# Altium schematic sheet MOSFET_bank.SchDoc
size B; SheetNumber: 2; SheetTotal: 4
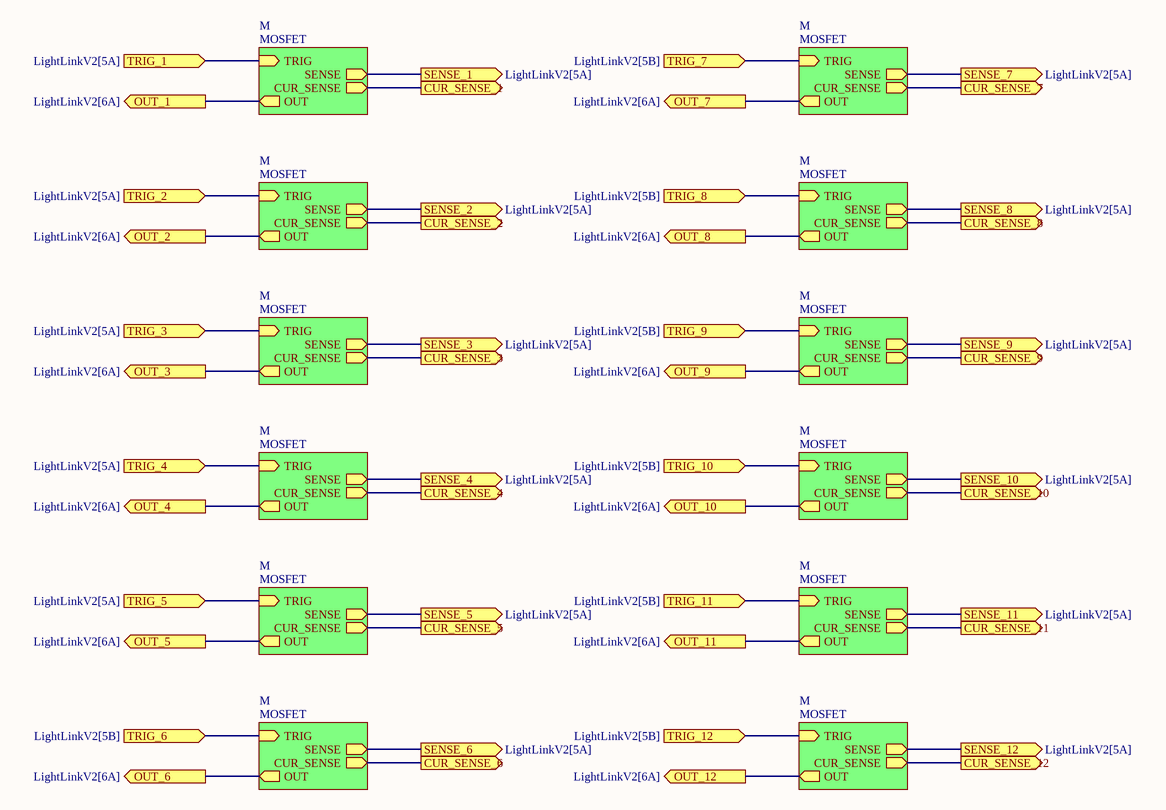
[diagram p0: MOSFET_bank.SchDoc]

## Sub-sheets
M = MOSFET: TRIG (in), OUT (out), SENSE (out), CUR_SENSE (out)
M = MOSFET: TRIG (in), OUT (out), SENSE (out), CUR_SENSE (out)
M = MOSFET: TRIG (in), OUT (out), SENSE (out), CUR_SENSE (out)
M = MOSFET: TRIG (in), OUT (out), SENSE (out), CUR_SENSE (out)
M = MOSFET: TRIG (in), OUT (out), SENSE (out), CUR_SENSE (out)
M = MOSFET: TRIG (in), OUT (out), SENSE (out), CUR_SENSE (out)
M = MOSFET: TRIG (in), OUT (out), SENSE (out), CUR_SENSE (out)
M = MOSFET: TRIG (in), OUT (out), SENSE (out), CUR_SENSE (out)
M = MOSFET: TRIG (in), OUT (out), SENSE (out), CUR_SENSE (out)
M = MOSFET: TRIG (in), OUT (out), SENSE (out), CUR_SENSE (out)
M = MOSFET: TRIG (in), OUT (out), SENSE (out), CUR_SENSE (out)
M = MOSFET: TRIG (in), OUT (out), SENSE (out), CUR_SENSE (out)

## Ports
CUR_SENSE_1 (out), CUR_SENSE_2 (out), CUR_SENSE_3 (out), CUR_SENSE_4 (out), CUR_SENSE_5 (out), CUR_SENSE_6 (out), CUR_SENSE_7 (out), CUR_SENSE_8 (out), CUR_SENSE_9 (out), CUR_SENSE_10 (out), CUR_SENSE_11 (out), CUR_SENSE_12 (out), OUT_1 (out, see LightLinkV2[6A]), OUT_2 (out, see LightLinkV2[6A]), OUT_3 (out, see LightLinkV2[6A]), OUT_4 (out, see LightLinkV2[6A]), OUT_5 (out, see LightLinkV2[6A]), OUT_6 (out, see LightLinkV2[6A]), OUT_7 (out, see LightLinkV2[6A]), OUT_8 (out, see LightLinkV2[6A]), OUT_9 (out, see LightLinkV2[6A]), OUT_10 (out, see LightLinkV2[6A]), OUT_11 (out, see LightLinkV2[6A]), OUT_12 (out, see LightLinkV2[6A]), SENSE_1 (out, see LightLinkV2[5A]), SENSE_2 (out, see LightLinkV2[5A]), SENSE_3 (out, see LightLinkV2[5A]), SENSE_4 (out, see LightLinkV2[5A]), SENSE_5 (out, see LightLinkV2[5A]), SENSE_6 (out, see LightLinkV2[5A]), SENSE_7 (out, see LightLinkV2[5A]), SENSE_8 (out, see LightLinkV2[5A]), SENSE_9 (out, see LightLinkV2[5A]), SENSE_10 (out, see LightLinkV2[5A]), SENSE_11 (out, see LightLinkV2[5A]), SENSE_12 (out, see LightLinkV2[5A]), TRIG_1 (in, see LightLinkV2[5A]), TRIG_2 (in, see LightLinkV2[5A]), TRIG_3 (in, see LightLinkV2[5A]), TRIG_4 (in, see LightLinkV2[5A]), TRIG_5 (in, see LightLinkV2[5A]), TRIG_6 (in, see LightLinkV2[5B]), TRIG_7 (in, see LightLinkV2[5B]), TRIG_8 (in, see LightLinkV2[5B]), TRIG_9 (in, see LightLinkV2[5B]), TRIG_10 (in, see LightLinkV2[5B]), TRIG_11 (in, see LightLinkV2[5B]), TRIG_12 (in, see LightLinkV2[5B])

## Nets
CUR_SENSE_1: port CUR_SENSE_1, sheet M/CUR_SENSE
CUR_SENSE_2: port CUR_SENSE_2, sheet M/CUR_SENSE
CUR_SENSE_3: port CUR_SENSE_3, sheet M/CUR_SENSE
CUR_SENSE_4: port CUR_SENSE_4, sheet M/CUR_SENSE
CUR_SENSE_5: port CUR_SENSE_5, sheet M/CUR_SENSE
CUR_SENSE_6: port CUR_SENSE_6, sheet M/CUR_SENSE
CUR_SENSE_7: port CUR_SENSE_7, sheet M/CUR_SENSE
CUR_SENSE_8: port CUR_SENSE_8, sheet M/CUR_SENSE
CUR_SENSE_9: port CUR_SENSE_9, sheet M/CUR_SENSE
CUR_SENSE_10: port CUR_SENSE_10, sheet M/CUR_SENSE
CUR_SENSE_11: port CUR_SENSE_11, sheet M/CUR_SENSE
CUR_SENSE_12: port CUR_SENSE_12, sheet M/CUR_SENSE
OUT_1: port OUT_1, sheet M/OUT
OUT_2: port OUT_2, sheet M/OUT
OUT_3: port OUT_3, sheet M/OUT
OUT_4: port OUT_4, sheet M/OUT
OUT_5: port OUT_5, sheet M/OUT
OUT_6: port OUT_6, sheet M/OUT
OUT_7: port OUT_7, sheet M/OUT
OUT_8: port OUT_8, sheet M/OUT
OUT_9: port OUT_9, sheet M/OUT
OUT_10: port OUT_10, sheet M/OUT
OUT_11: port OUT_11, sheet M/OUT
OUT_12: port OUT_12, sheet M/OUT
SENSE_1: port SENSE_1, sheet M/SENSE
SENSE_2: port SENSE_2, sheet M/SENSE
SENSE_3: port SENSE_3, sheet M/SENSE
SENSE_4: port SENSE_4, sheet M/SENSE
SENSE_5: port SENSE_5, sheet M/SENSE
SENSE_6: port SENSE_6, sheet M/SENSE
SENSE_7: port SENSE_7, sheet M/SENSE
SENSE_8: port SENSE_8, sheet M/SENSE
SENSE_9: port SENSE_9, sheet M/SENSE
SENSE_10: port SENSE_10, sheet M/SENSE
SENSE_11: port SENSE_11, sheet M/SENSE
SENSE_12: port SENSE_12, sheet M/SENSE
TRIG_1: port TRIG_1, sheet M/TRIG
TRIG_2: port TRIG_2, sheet M/TRIG
TRIG_3: port TRIG_3, sheet M/TRIG
TRIG_4: port TRIG_4, sheet M/TRIG
TRIG_5: port TRIG_5, sheet M/TRIG
TRIG_6: port TRIG_6, sheet M/TRIG
TRIG_7: port TRIG_7, sheet M/TRIG
TRIG_8: port TRIG_8, sheet M/TRIG
TRIG_9: port TRIG_9, sheet M/TRIG
TRIG_10: port TRIG_10, sheet M/TRIG
TRIG_11: port TRIG_11, sheet M/TRIG
TRIG_12: port TRIG_12, sheet M/TRIG